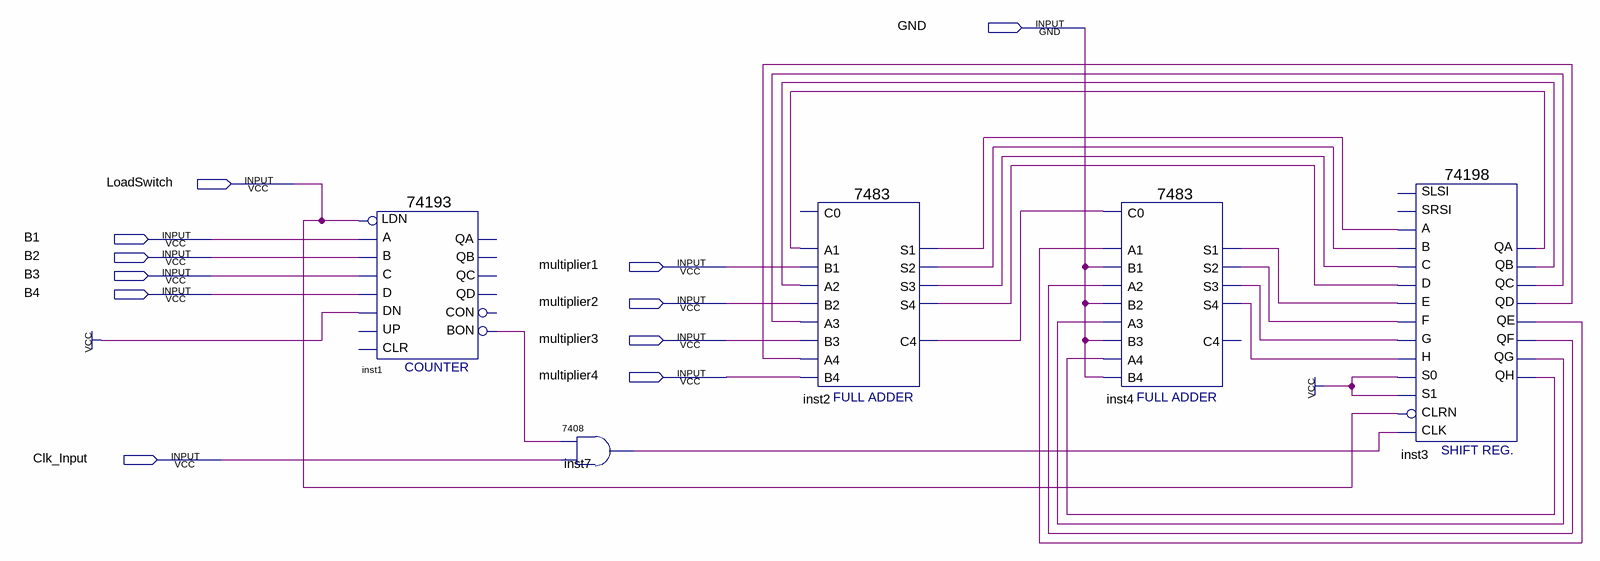
[diagram p0: schematic sheet]
// Quartus schematic multiplier_schematic.bdf as structural Verilog: 5 symbols, 11 pins
module multiplier_schematic (
  input  GND,
  input  LoadSwitch,
  input  B1,
  input  B2,
  input  multiplier1,
  input  B3,
  input  B4,
  input  multiplier2,
  input  multiplier3,
  input  multiplier4,
  input  Clk_Input
);

  wire inst1_bon, inst2_c4, inst2_s1, inst2_s2, inst2_s3, inst2_s4, inst3_qa, inst3_qb, inst3_qc, inst3_qd,
       inst3_qe, inst3_qf, inst3_qg, inst3_qh, inst4_s1, inst4_s2, inst4_s3, inst4_s4, inst7_1;

  \74193  inst1 (
    .D(B4), .C(B3), .B(B2), .A(B1), .DN(1'b1), .LDN(LoadSwitch), .BON(inst1_bon));  // open: CLR, UP, QB, QA, CON, QD, QC
  \7408  inst7 (.\3 (Clk_Input), .\2 (inst1_bon), .\1 (inst7_1));
  \7483  inst2 (
    .B4(multiplier4), .A1(inst3_qa), .A2(inst3_qb), .B1(multiplier1), .B2(multiplier2), .A3(inst3_qc),
    .B3(multiplier3), .A4(inst3_qd), .S3(inst2_s3), .S4(inst2_s4), .S2(inst2_s2), .C4(inst2_c4), .S1(inst2_s1));  // open: C0
  \7483  inst4 (
    .B4(GND), .C0(inst2_c4), .A1(inst3_qe), .A2(inst3_qf), .B1(GND), .B2(GND), .A3(inst3_qg), .B3(GND),
    .A4(inst3_qh), .S3(inst4_s3), .S4(inst4_s4), .S2(inst4_s2), .S1(inst4_s1));  // open: C4
  \74198  inst3 (
    .A(inst2_s1), .E(inst4_s1), .S0(1'b1), .B(inst2_s2), .C(inst2_s3), .D(inst2_s4), .H(inst4_s4),
    .G(inst4_s3), .CLRN(LoadSwitch), .CLK(inst7_1), .F(inst4_s2), .S1(1'b1), .QD(inst3_qd), .QC(inst3_qc),
    .QH(inst3_qh), .QA(inst3_qa), .QB(inst3_qb), .QE(inst3_qe), .QF(inst3_qf), .QG(inst3_qg));  // open: SRSI, SLSI
endmodule
